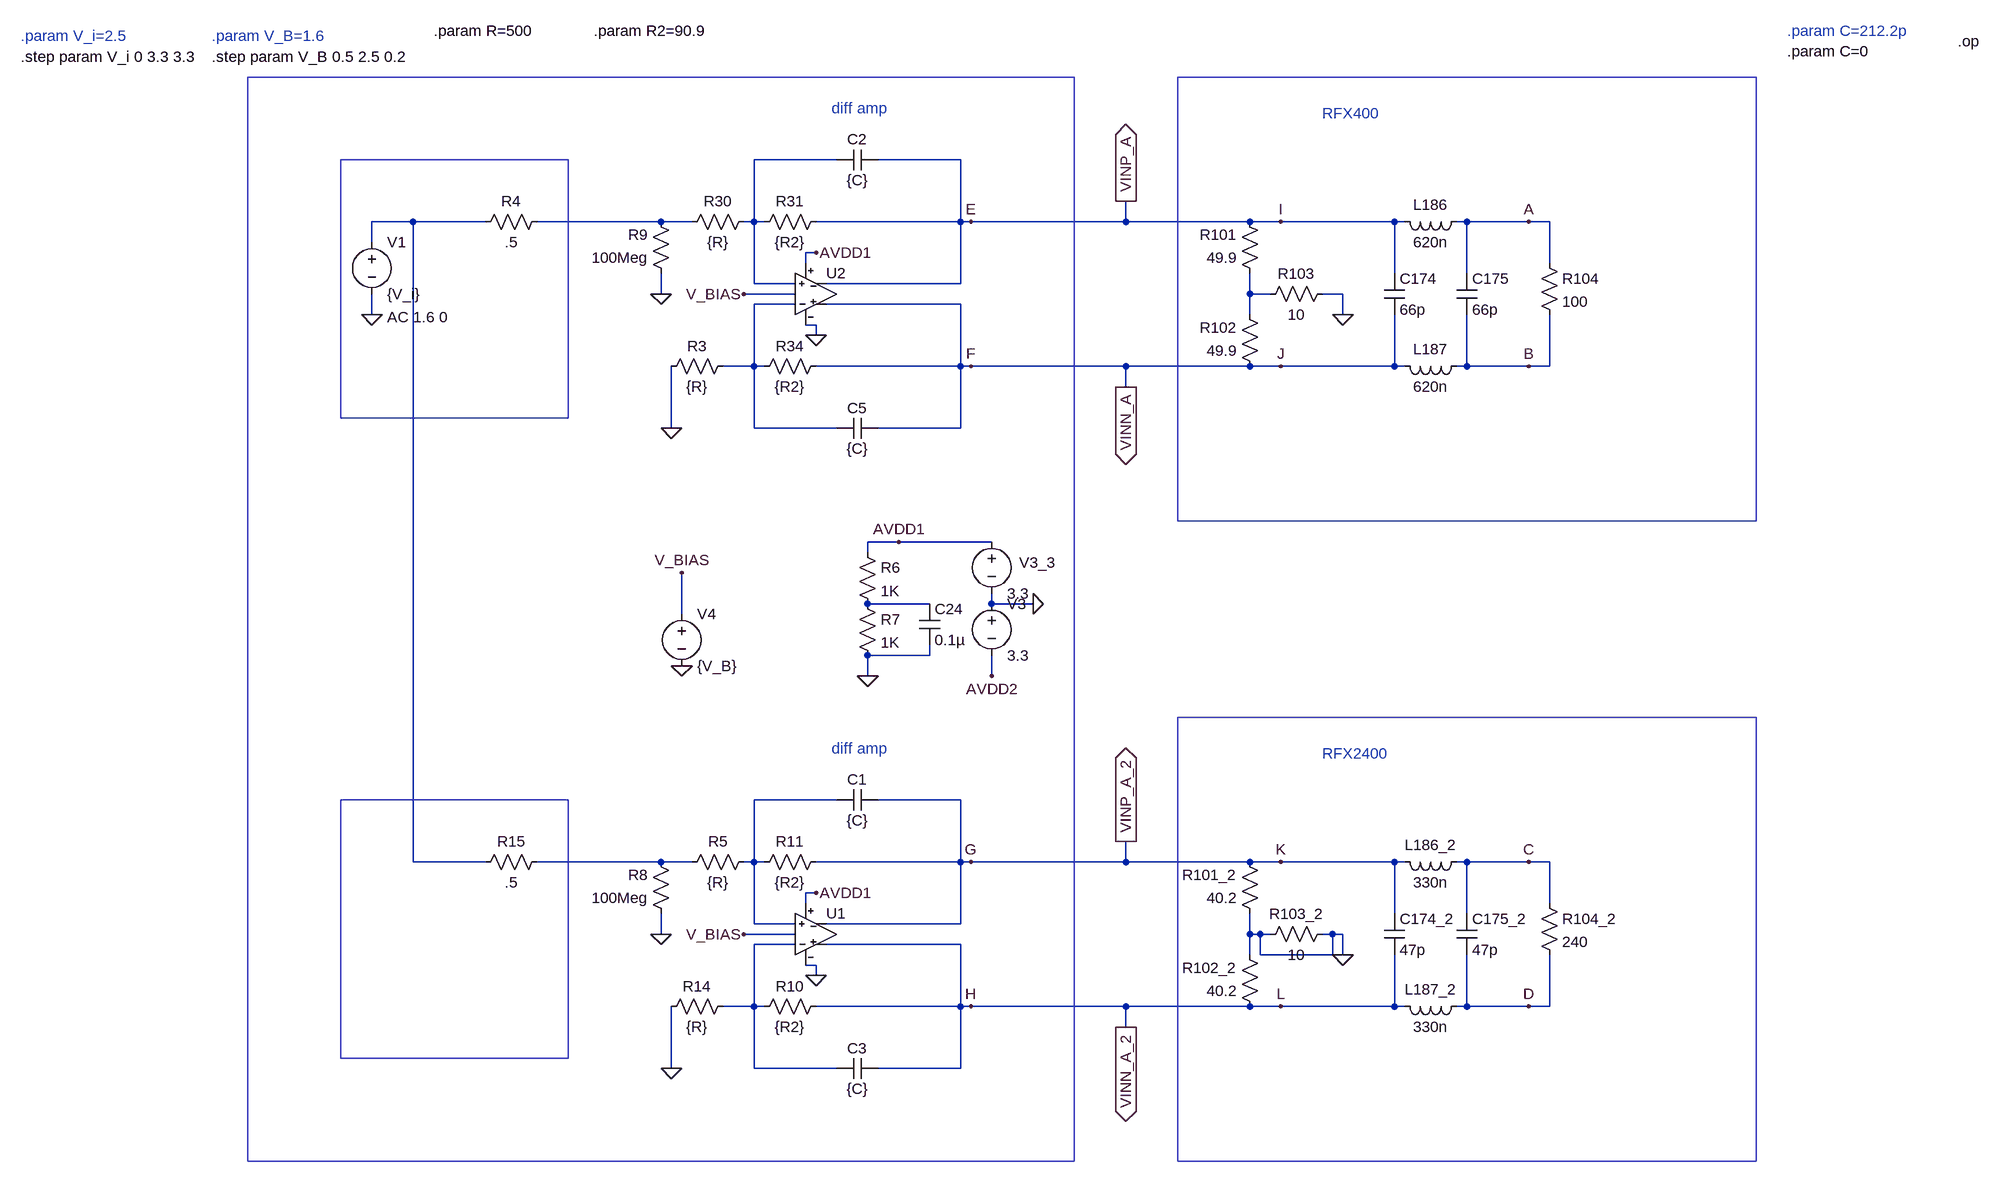
[diagram p0: schematic DA-AD8137-rfx.2.asc]
DA-AD8137-rfx.2.asc, the LTspice schematic file:
Version 4
SHEET 1 1920 1892
WIRE 144 -48 16 -48
WIRE 336 -48 208 -48
WIRE -512 48 -576 48
WIRE -400 48 -512 48
WIRE -128 48 -320 48
WIRE -80 48 -128 48
WIRE 16 48 16 -48
WIRE 16 48 0 48
WIRE 32 48 16 48
WIRE 336 48 336 -48
WIRE 336 48 112 48
WIRE 352 48 336 48
WIRE 592 48 592 16
WIRE 592 48 352 48
WIRE 784 48 592 48
WIRE 832 48 784 48
WIRE 1008 48 832 48
WIRE 1024 48 1008 48
WIRE 1120 48 1104 48
WIRE 1216 48 1120 48
WIRE 1248 48 1216 48
WIRE -576 80 -576 48
WIRE 112 96 96 96
WIRE 96 112 96 96
WIRE 1248 112 1248 48
WIRE 1008 128 1008 48
WIRE 1120 128 1120 48
WIRE 16 144 16 48
WIRE 80 144 16 144
WIRE 336 144 336 48
WIRE 336 144 128 144
WIRE -128 160 -128 128
WIRE 80 160 0 160
WIRE 784 160 784 128
WIRE 816 160 784 160
WIRE 928 160 896 160
WIRE 80 176 16 176
WIRE 336 176 128 176
WIRE -576 192 -576 160
WIRE 784 192 784 160
WIRE 928 192 928 160
WIRE 112 208 96 208
WIRE 112 224 112 208
WIRE 16 272 16 176
WIRE 16 272 -32 272
WIRE 32 272 16 272
WIRE 336 272 336 176
WIRE 336 272 112 272
WIRE 352 272 336 272
WIRE 592 272 352 272
WIRE 784 272 592 272
WIRE 832 272 784 272
WIRE 1008 272 1008 192
WIRE 1008 272 832 272
WIRE 1024 272 1008 272
WIRE 1120 272 1120 192
WIRE 1120 272 1104 272
WIRE 1216 272 1120 272
WIRE 1248 272 1248 192
WIRE 1248 272 1216 272
WIRE 592 304 592 272
WIRE -112 368 -112 272
WIRE 16 368 16 272
WIRE 144 368 16 368
WIRE 336 368 336 272
WIRE 336 368 208 368
WIRE 240 544 192 544
WIRE 384 544 240 544
WIRE 192 560 192 544
WIRE 288 640 192 640
WIRE 384 640 384 624
WIRE 448 640 384 640
WIRE -96 656 -96 592
WIRE 288 720 288 704
WIRE 288 720 192 720
WIRE 192 752 192 720
WIRE 384 752 384 720
WIRE 144 944 16 944
WIRE 336 944 208 944
WIRE -512 1040 -512 48
WIRE -400 1040 -512 1040
WIRE -128 1040 -320 1040
WIRE -80 1040 -128 1040
WIRE 16 1040 16 944
WIRE 16 1040 0 1040
WIRE 32 1040 16 1040
WIRE 336 1040 336 944
WIRE 336 1040 112 1040
WIRE 352 1040 336 1040
WIRE 592 1040 592 1008
WIRE 592 1040 352 1040
WIRE 784 1040 592 1040
WIRE 832 1040 784 1040
WIRE 1008 1040 832 1040
WIRE 1024 1040 1008 1040
WIRE 1120 1040 1104 1040
WIRE 1216 1040 1120 1040
WIRE 1248 1040 1216 1040
WIRE 112 1088 96 1088
WIRE 96 1104 96 1088
WIRE 1248 1104 1248 1040
WIRE 1008 1120 1008 1040
WIRE 1120 1120 1120 1040
WIRE 16 1136 16 1040
WIRE 80 1136 16 1136
WIRE 336 1136 336 1040
WIRE 336 1136 128 1136
WIRE -128 1152 -128 1120
WIRE 80 1152 0 1152
WIRE 784 1152 784 1120
WIRE 800 1152 784 1152
WIRE 816 1152 800 1152
WIRE 912 1152 896 1152
WIRE 928 1152 912 1152
WIRE 80 1168 16 1168
WIRE 336 1168 128 1168
WIRE 784 1184 784 1152
WIRE 800 1184 800 1152
WIRE 912 1184 912 1152
WIRE 912 1184 800 1184
WIRE 928 1184 928 1152
WIRE 112 1200 96 1200
WIRE 112 1216 112 1200
WIRE 16 1264 16 1168
WIRE 16 1264 -32 1264
WIRE 32 1264 16 1264
WIRE 336 1264 336 1168
WIRE 336 1264 112 1264
WIRE 352 1264 336 1264
WIRE 592 1264 352 1264
WIRE 784 1264 592 1264
WIRE 832 1264 784 1264
WIRE 1008 1264 1008 1184
WIRE 1008 1264 832 1264
WIRE 1024 1264 1008 1264
WIRE 1120 1264 1120 1184
WIRE 1120 1264 1104 1264
WIRE 1216 1264 1120 1264
WIRE 1248 1264 1248 1184
WIRE 1248 1264 1216 1264
WIRE 592 1296 592 1264
WIRE -112 1360 -112 1264
WIRE 16 1360 16 1264
WIRE 144 1360 16 1360
WIRE 336 1360 336 1264
WIRE 336 1360 208 1360
FLAG -128 160 0
FLAG 592 304 VINN_A
IOPIN 592 304 Out
FLAG 592 16 VINP_A
IOPIN 592 16 Out
FLAG -576 192 0
FLAG 240 544 AVDD1
FLAG 448 640 0
FLAG 112 96 AVDD1
FLAG 112 224 0
FLAG 192 752 0
FLAG -96 592 V_BIAS
FLAG 0 160 V_BIAS
FLAG -112 368 0
FLAG 384 752 AVDD2
FLAG -128 1152 0
FLAG 112 1088 AVDD1
FLAG 112 1216 0
FLAG 0 1152 V_BIAS
FLAG -112 1360 0
FLAG 928 192 0
FLAG 592 1296 VINN_A_2
IOPIN 592 1296 Out
FLAG 592 1008 VINP_A_2
IOPIN 592 1008 Out
FLAG 928 1184 0
FLAG 1216 48 A
FLAG 1216 272 B
FLAG 1216 1040 C
FLAG 1216 1264 D
FLAG -96 736 0
FLAG 352 48 E
FLAG 352 272 F
FLAG 352 1040 G
FLAG 352 1264 H
FLAG 832 48 I
FLAG 832 272 J
FLAG 832 1040 K
FLAG 832 1264 L
SYMBOL res 16 32 R90
WINDOW 0 0 56 VBottom 0
WINDOW 3 32 56 VTop 0
SYMATTR InstName R30
SYMATTR Value {R}
SYMATTR SpiceLine tol=1 pwr=0.1
SYMBOL res -112 144 R180
WINDOW 0 36 76 Left 0
WINDOW 3 36 40 Left 0
SYMATTR InstName R9
SYMATTR Value 100Meg
SYMATTR SpiceLine tol=1 pwr=0.1
SYMBOL res 128 256 R90
WINDOW 0 0 56 VBottom 0
WINDOW 3 32 56 VTop 0
SYMATTR InstName R34
SYMATTR Value {R2}
SYMATTR SpiceLine tol=1 pwr=0.1
SYMBOL res 128 32 R90
WINDOW 0 0 56 VBottom 0
WINDOW 3 32 56 VTop 0
SYMATTR InstName R31
SYMATTR Value {R2}
SYMATTR SpiceLine tol=1 pwr=0.1
SYMBOL res 800 288 R180
WINDOW 0 36 76 Left 0
WINDOW 3 36 40 Left 0
SYMATTR InstName R102
SYMATTR Value 49.9
SYMATTR SpiceLine tol=1 pwr=0.1
SYMBOL voltage -576 64 R0
WINDOW 123 24 132 Left 0
WINDOW 39 24 132 Left 0
SYMATTR Value2 AC 1.6 0
SYMATTR InstName V1
SYMATTR Value {V_i}
SYMBOL voltage 384 528 R0
WINDOW 123 0 0 Left 0
WINDOW 39 0 0 Left 0
WINDOW 0 43 48 Left 0
SYMATTR InstName V3_3
SYMATTR Value 3.3
SYMBOL res 176 544 R0
SYMATTR InstName R6
SYMATTR Value 1K
SYMATTR SpiceLine tol=1 pwr=0.1
SYMBOL res 176 624 R0
SYMATTR InstName R7
SYMATTR Value 1K
SYMATTR SpiceLine tol=1 pwr=0.1
SYMBOL cap 272 640 R0
SYMATTR InstName C24
SYMATTR Value 0.1µ
SYMBOL res 800 144 R180
WINDOW 0 36 76 Left 0
WINDOW 3 36 40 Left 0
SYMATTR InstName R101
SYMATTR Value 49.9
SYMBOL cap 208 -64 R90
WINDOW 0 0 32 VBottom 0
WINDOW 3 32 32 VTop 0
SYMATTR InstName C2
SYMATTR Value {C}
SYMBOL cap 208 384 M270
WINDOW 0 32 32 VTop 0
WINDOW 3 0 32 VBottom 0
SYMATTR InstName C5
SYMATTR Value {C}
SYMBOL res -16 256 R90
WINDOW 0 0 56 VBottom 0
WINDOW 3 32 56 VTop 0
SYMATTR InstName R3
SYMATTR Value {R}
SYMATTR SpiceLine tol=1 pwr=0.1
SYMBOL ad8137 112 160 R0
SYMATTR InstName U2
SYMBOL voltage 384 624 R0
WINDOW 123 0 0 Left 0
WINDOW 39 0 0 Left 0
SYMATTR InstName V3
SYMATTR Value 3.3
SYMBOL res -304 32 R90
WINDOW 0 0 56 VBottom 0
WINDOW 3 32 56 VTop 0
SYMATTR InstName R4
SYMATTR Value .5
SYMBOL res 16 1024 R90
WINDOW 0 0 56 VBottom 0
WINDOW 3 32 56 VTop 0
SYMATTR InstName R5
SYMATTR Value {R}
SYMATTR SpiceLine tol=1 pwr=0.1
SYMBOL res -112 1136 R180
WINDOW 0 36 76 Left 0
WINDOW 3 36 40 Left 0
SYMATTR InstName R8
SYMATTR Value 100Meg
SYMATTR SpiceLine tol=1 pwr=0.1
SYMBOL res 128 1248 R90
WINDOW 0 0 56 VBottom 0
WINDOW 3 32 56 VTop 0
SYMATTR InstName R10
SYMATTR Value {R2}
SYMATTR SpiceLine tol=1 pwr=0.1
SYMBOL res 128 1024 R90
WINDOW 0 0 56 VBottom 0
WINDOW 3 32 56 VTop 0
SYMATTR InstName R11
SYMATTR Value {R2}
SYMATTR SpiceLine tol=1 pwr=0.1
SYMBOL cap 208 928 R90
WINDOW 0 0 32 VBottom 0
WINDOW 3 32 32 VTop 0
SYMATTR InstName C1
SYMATTR Value {C}
SYMBOL cap 208 1376 M270
WINDOW 0 32 32 VTop 0
WINDOW 3 0 32 VBottom 0
SYMATTR InstName C3
SYMATTR Value {C}
SYMBOL res -16 1248 R90
WINDOW 0 0 56 VBottom 0
WINDOW 3 32 56 VTop 0
SYMATTR InstName R14
SYMATTR Value {R}
SYMATTR SpiceLine tol=1 pwr=0.1
SYMBOL ad8137 112 1152 R0
SYMATTR InstName U1
SYMBOL res -304 1024 R90
WINDOW 0 0 56 VBottom 0
WINDOW 3 32 56 VTop 0
SYMATTR InstName R15
SYMATTR Value .5
SYMBOL res 800 176 R270
WINDOW 0 32 56 VTop 0
WINDOW 3 0 56 VBottom 0
SYMATTR InstName R103
SYMATTR Value 10
SYMBOL cap 992 128 R0
SYMATTR InstName C174
SYMATTR Value 66p
SYMBOL cap 1104 128 R0
SYMATTR InstName C175
SYMATTR Value 66p
SYMBOL res 1232 96 R0
SYMATTR InstName R104
SYMATTR Value 100
SYMBOL ind 1120 32 R90
WINDOW 0 5 56 VBottom 0
WINDOW 3 32 56 VTop 0
SYMATTR InstName L186
SYMATTR Value 620n
SYMBOL ind 1120 256 R90
WINDOW 0 5 56 VBottom 0
WINDOW 3 32 56 VTop 0
SYMATTR InstName L187
SYMATTR Value 620n
SYMBOL res 800 1280 R180
WINDOW 0 36 76 Left 0
WINDOW 3 36 40 Left 0
SYMATTR InstName R102_2
SYMATTR Value 40.2
SYMATTR SpiceLine tol=1 pwr=0.1
SYMBOL res 800 1136 R180
WINDOW 0 36 76 Left 0
WINDOW 3 36 40 Left 0
SYMATTR InstName R101_2
SYMATTR Value 40.2
SYMBOL res 800 1168 R270
WINDOW 0 32 56 VTop 0
WINDOW 3 0 56 VBottom 0
SYMATTR InstName R103_2
SYMATTR Value 10
SYMBOL cap 992 1120 R0
SYMATTR InstName C174_2
SYMATTR Value 47p
SYMBOL cap 1104 1120 R0
SYMATTR InstName C175_2
SYMATTR Value 47p
SYMBOL res 1232 1088 R0
SYMATTR InstName R104_2
SYMATTR Value 240
SYMBOL ind 1120 1024 R90
WINDOW 0 5 56 VBottom 0
WINDOW 3 32 56 VTop 0
SYMATTR InstName L186_2
SYMATTR Value 330n
SYMBOL ind 1120 1248 R90
WINDOW 0 5 56 VBottom 0
WINDOW 3 32 56 VTop 0
SYMATTR InstName L187_2
SYMATTR Value 330n
SYMBOL voltage -96 640 R0
SYMATTR InstName V4
SYMATTR Value {V_B}
TEXT 1880 -232 Left 0 !.op
TEXT 896 -120 Left 0 ;RFX400
TEXT 1616 -248 Left 0 ;.param C=212.2p
TEXT 1616 -216 Left 0 !.param C=0
TEXT 136 -128 Left 0 ;diff amp
TEXT 136 864 Left 0 ;diff amp
TEXT 896 872 Left 0 ;RFX2400
TEXT -480 -248 Left 0 !.param R=500
TEXT -824 -240 Left 0 ;.param V_B=1.6
TEXT -824 -208 Left 0 !.step param V_B 0.5 2.5 0.2
TEXT -1120 -208 Left 0 !.step param V_i 0 3.3 3.3
TEXT -232 -248 Left 0 !.param R2=90.9
TEXT -1120 -240 Left 0 ;.param V_i=2.5
RECTANGLE Normal -768 1504 512 -176
RECTANGLE Normal 1568 512 672 -176
RECTANGLE Normal -272 352 -624 -48
RECTANGLE Normal -272 1344 -624 944
RECTANGLE Normal 1568 1504 672 816

The netlist it stands for:
* DA-AD8137-rfx.2.asc
R30 N001 N003 {R} tol=1 pwr=0.1
R9 0 N003 100Meg tol=1 pwr=0.1
R34 J N005 {R2} tol=1 pwr=0.1
R31 I N001 {R2} tol=1 pwr=0.1
R102 J N004 49.9 tol=1 pwr=0.1
V1 N002 0 {V_i} AC 1.6 0
V3_3 AVDD1 0 3.3
R6 AVDD1 N006 1K tol=1 pwr=0.1
R7 N006 0 1K tol=1 pwr=0.1
C24 N006 0 0.1µ
R101 N004 I 49.9
C2 I N001 {C}
C5 J N005 {C}
R3 N005 0 {R} tol=1 pwr=0.1
XU2 N001 N005 AVDD1 0 J I V_BIAS AD8137  ; pins In+ In- V+ V- OUT+ OUT- VOCM
V3 0 AVDD2 3.3
R4 N003 N002 .5
R5 N007 N008 {R} tol=1 pwr=0.1
R8 0 N008 100Meg tol=1 pwr=0.1
R10 L N009 {R2} tol=1 pwr=0.1
R11 K N007 {R2} tol=1 pwr=0.1
C1 K N007 {C}
C3 L N009 {C}
R14 N009 0 {R} tol=1 pwr=0.1
XU1 N007 N009 AVDD1 0 L K V_BIAS AD8137  ; pins In+ In- V+ V- OUT+ OUT- VOCM
R15 N008 N002 .5
R103 N004 0 10
C174 I J 66p
C175 A B 66p
R104 A B 100
L186 A I 620n
L187 B J 620n
R102_2 L 0 40.2 tol=1 pwr=0.1
R101_2 0 K 40.2
R103_2 0 0 10
C174_2 K L 47p
C175_2 C D 47p
R104_2 C D 240
L186_2 C K 330n
L187_2 D L 330n
V4 V_BIAS 0 {V_B}
.op
* RFX400
* .param C=212.2p
.param C=0
* diff amp
* diff amp
* RFX2400
.param R=500
* .param V_B=1.6
.step param V_B 0.5 2.5 0.2
.step param V_i 0 3.3 3.3
.param R2=90.9
* .param V_i=2.5
.lib ad8137.cir
.backanno
.end